# EAGLE board pico_daw_v0.3 (EAGLE 4.16), part 1 of 2
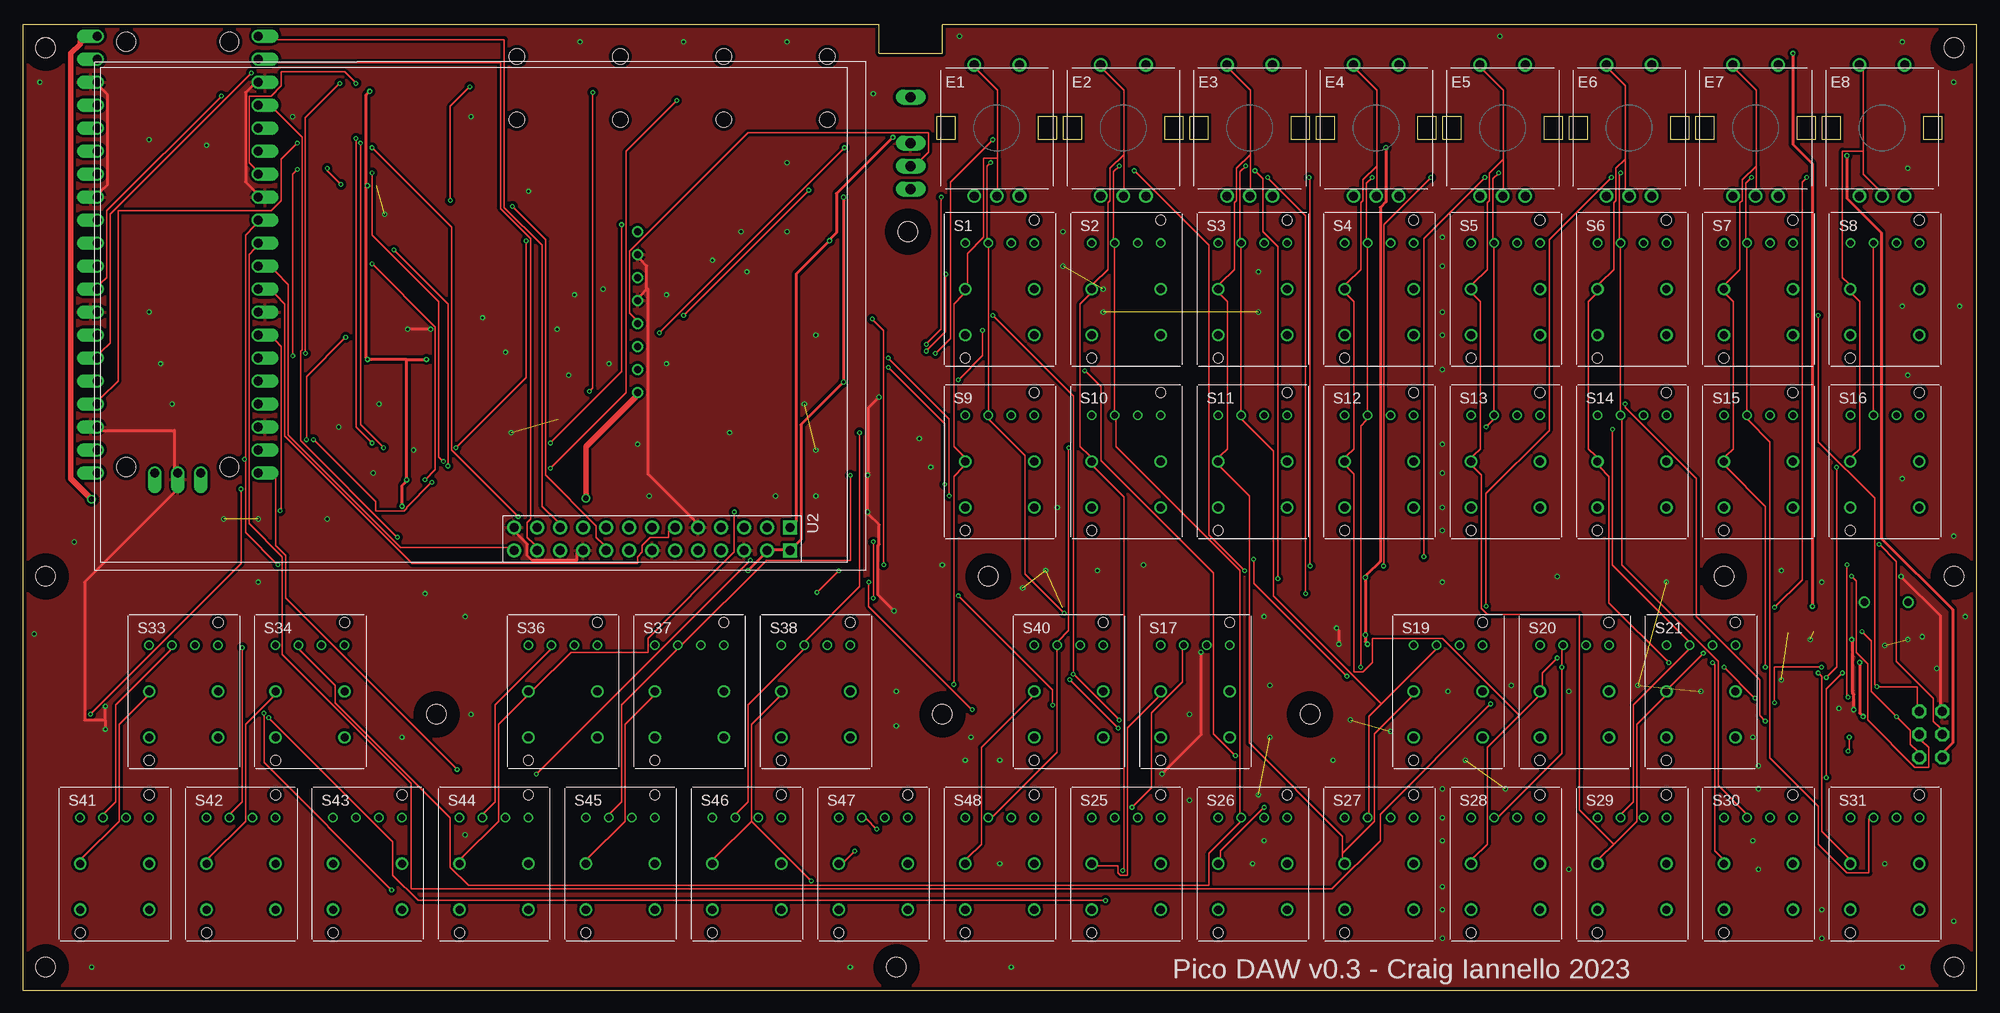
[diagram p1: board, top side]
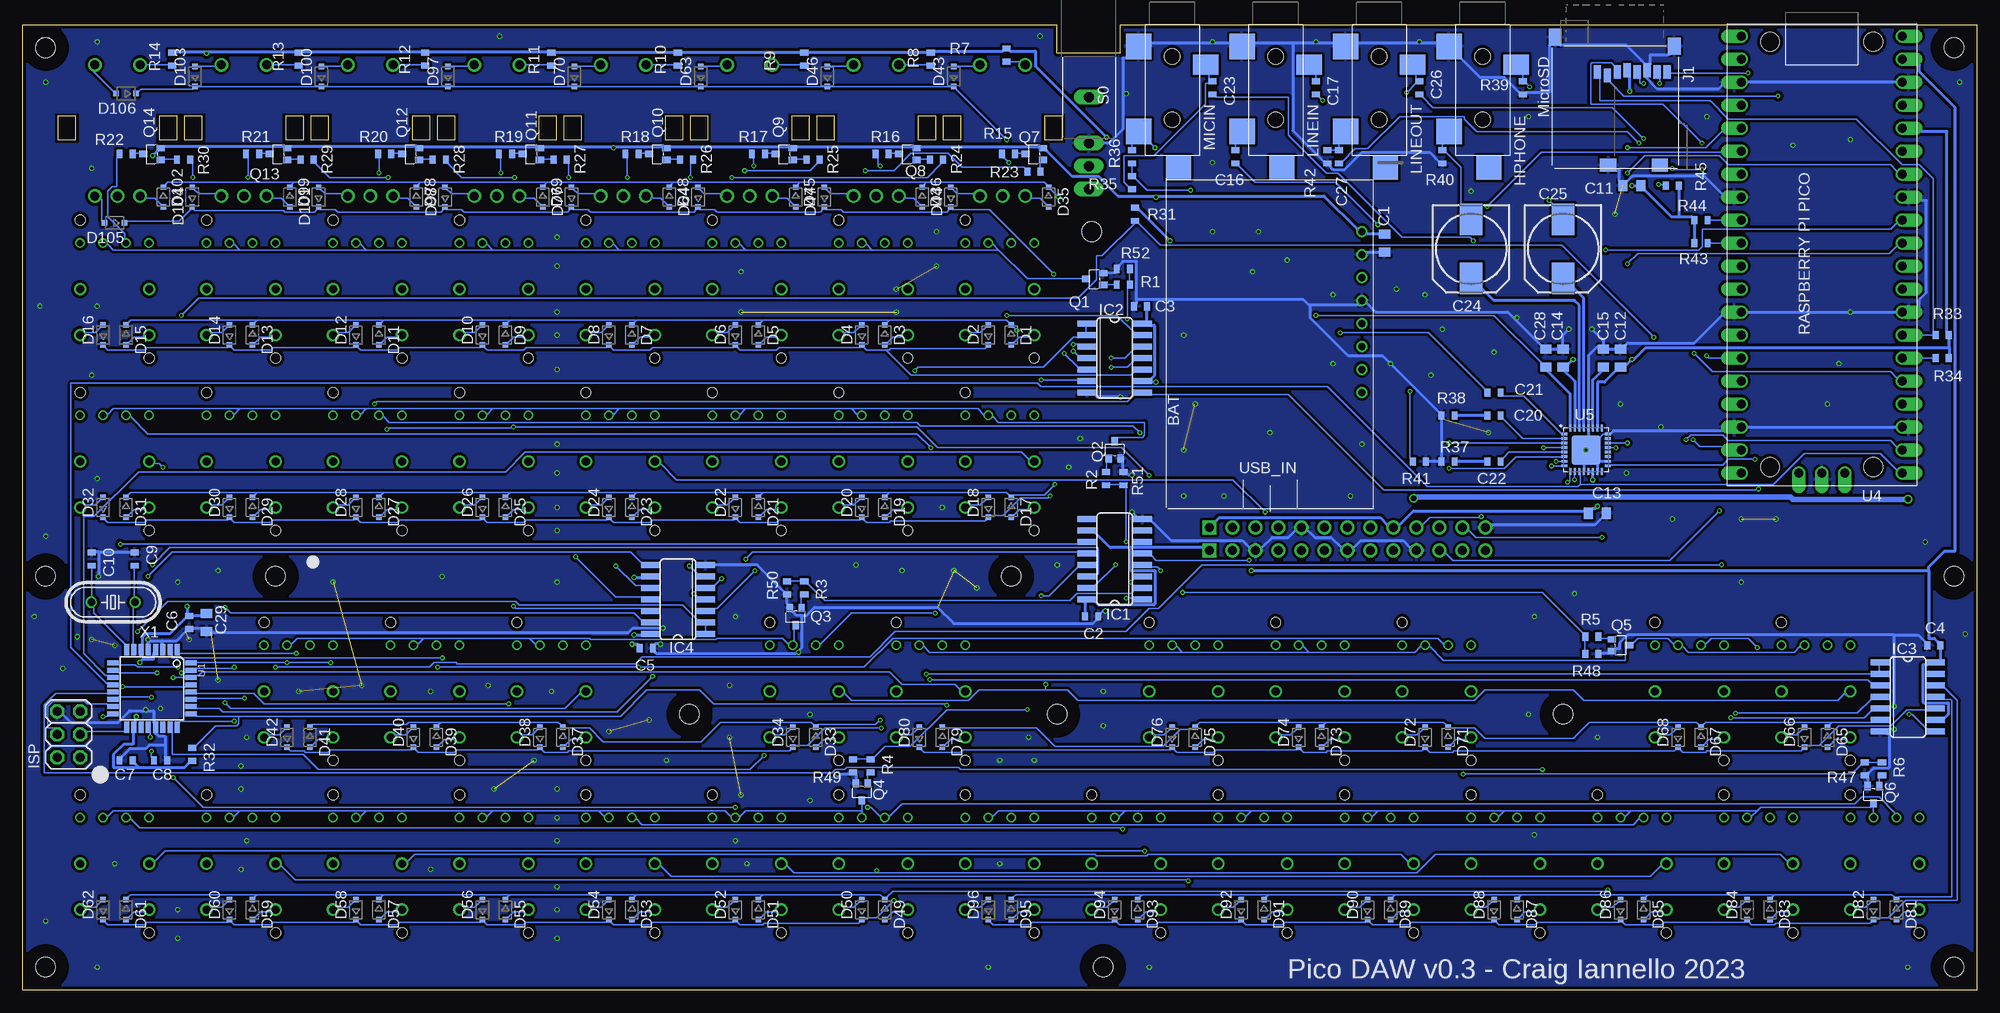
[diagram p2: board, bottom side, seen from below]

Size 215.9 x 106.68 mm. Coordinates in mm from the lower left corner, seen from the top.
Outline: 0,0 215.9,0 215.9,106.68 101.6,106.68 101.6,103.5 94.61,103.5 94.61,106.68 0,106.68 0,0
Copper layers (1*16): Top 0.0356mm / dielectric 1.6mm / Bottom 0.0356mm
Design rules "oshpark-2layer": minimum track width 6mil, minimum drill 10mil, track to track 6mil, track to pad 6mil, pad to pad 6mil, via to via 6mil, smd to smd 6mil, copper to edge 15mil, drill to drill 6mil, minimum pad ring 5mil, minimum via ring 5mil, stop-mask expansion 2.5mil, vias tented up to drill 0mil, thermal gap 10mil
Net classes: 0 default: width 0.152 mm, drill 0.152 mm, clearance 0.254 mm; 1 high_power: width 0.61 mm, drill 0.33 mm, clearance 0.61 mm; 2 mid_power: width 0.305 mm, drill 0.152 mm, clearance 0.305 mm
Holes 2.18 mm at 213.36,2.54 213.36,104.14 2.54,104.14 2.54,2.54 45.72,30.48 96.52,2.54 142.24,30.48 97.79,83.82 213.36,45.72 106.68,45.72 2.54,45.72 101.6,30.48 187.96,45.72
tRestrict: area 0,101.6 to 5.1,106.7; area 0,43.2 to 5.1,48.3; area 0,0 to 5.1,5.1; area 43.2,27.9 to 48.3,33; area 99.1,27.9 to 104.1,33; area 104.1,43.2 to 109.2,48.3; area 95.2,81.3 to 100.3,86.4; area 94,0 to 99.1,5.1; area 139.7,27.9 to 144.8,33; area 185.4,43.2 to 190.5,48.3; area 210.8,43.2 to 215.9,48.3; area 210.8,0 to 215.9,5.1; 1 more areas
bRestrict: area 0,101.6 to 5.1,106.7; area 0,43.2 to 5.1,48.3; area 0,0 to 5.1,5.1; area 43.2,27.9 to 48.3,33; area 99.1,27.9 to 104.1,33; area 104.1,43.2 to 109.2,48.3; area 95.2,81.3 to 100.3,86.4; area 94,0 to 99.1,5.1; area 139.7,27.9 to 144.8,33; area 185.4,43.2 to 190.5,48.3; area 210.8,43.2 to 215.9,48.3; area 210.8,0 to 215.9,5.1; 1 more areas

## Footprints (pad centres in the part's own frame; a part is rotated, then mirrored left to right if it is on the bottom)
0805 = smd 1.25 x 1: 1 0,1; 2 0,-1
0603 = smd 0.65 x 0.9: 1 -0.725,0; 2 0.725,0
150CLZ-0810 = smd 3.5 x 2.5: + 3.25,0; - -3.25,0
SOD323-R = smd 0.6 x 0.6: A 1.1,0; C -1.1,0
ENCODER_BOURNS_PEC12R-3225F-S0024 = drill 1 round: A -2.5,-7.5; B 2.5,-7.5; COM 0,-7.5; SW0 -2.5,7; SW1 2.5,7
HPHONE_CUI_SJ-3524-SMT-TR = smd 2.2 x 2.8: RING 4.4,3.7 | smd 2.8 x 2.8: SLEEVE 2.4,-3.7; TIP 11.8,-3.7 | smd 2.6 x 2.8: SWITCH 15.8,0.7 | hole 1.7: 3.5,0; 10.5,0
SO16 = smd 0.66 x 2.032: 1 -4.445,-3.073; 2 -3.175,-3.073; 3 -1.905,-3.073; 4 -0.635,-3.073; 5 0.635,-3.073; 6 1.905,-3.073; 7 3.175,-3.073; 8 4.445,-3.073; 9 4.445,3.073; 10 3.175,3.073; 11 1.905,3.073; 12 0.635,3.073; 13 -0.635,3.073; 14 -1.905,3.073; 15 -3.175,3.073; 16 -4.445,3.073
SO14 = smd 0.66 x 2.032: 1 -3.81,-3.073; 2 -2.54,-3.073; 3 -1.27,-3.073; 4 0,-3.073; 5 1.27,-3.073; 6 2.54,-3.073; 7 3.81,-3.073; 8 3.81,3.073; 9 2.54,3.073; 10 1.27,3.073; 11 0,3.073; 12 -1.27,3.073; 13 -2.54,3.073; 14 -3.81,3.073
2X03 = drill 1.016 octagon: 1 -2.54,-1.27; 2 -2.54,1.27; 3 0,-1.27; 4 0,1.27; 5 2.54,-1.27; 6 2.54,1.27
MICROSD_AMPHENOL_GTFP08432B1HR = smd 0.8 x 1.5: 1/DAT2 1.95,1.8; 2/CD/DAT3 0.85,2.2; 3/CMD -0.25,1.8; 4/VDD -1.35,1.6; 5/CLK -2.45,1.8; 6/VSS -3.55,1.6; 7/DAT0 -4.65,1.8; 8/DAT1 -5.75,1.8 | smd 1.8 x 1.4: CDET -4.95,12.1; GND0 0.75,12.1 | smd 1.4 x 1.9: GND1 -6.55,-1.05; GND2 6.6,-2.05
SC-70-3_SOT-323 = smd 0.7 x 0.9: 1 -0.65,-0.95; 2 0.65,-0.95; 3 0,0.95
ROCKER_SPDT_EG4328-ND = drill 1.09 long: 1 0,-5.135; 2 0,-7.675; 3 0,-10.215; ANCH 0,-0.055
PAD_PB86-A1 = drill 0.7 round: A -1.27,5.08; K 1.27,5.08; NC0 -3.81,5.08; NC1 3.81,5.08 | drill 0.9 round: COM0 -3.81,0; COM1 3.81,0; NC 3.81,-5.08; NO -3.81,-5.08 | hole 1.1: -3.81,-7.62; 3.81,7.62
TQFP32-08 = smd 1.27 x 0.559: 1 -4.293,2.8; 2 -4.293,2; 3 -4.293,1.2; 4 -4.293,0.4; 5 -4.293,-0.4; 6 -4.293,-1.2; 7 -4.293,-2; 8 -4.293,-2.8; 17 4.293,-2.8; 18 4.293,-2; 19 4.293,-1.2; 20 4.293,-0.4; 21 4.293,0.4; 22 4.293,1.2; 23 4.293,2; 24 4.293,2.8 | smd 0.559 x 1.27: 9 -2.8,-4.293; 10 -2,-4.293; 11 -1.2,-4.293; 12 -0.4,-4.293; 13 0.4,-4.293; 14 1.2,-4.293; 15 2,-4.293; 16 2.8,-4.293; 25 2.8,4.293; 26 2,4.293; 27 1.2,4.293; 28 0.4,4.293; 29 -0.4,4.293; 30 -1.2,4.293; 31 -2,4.293; 32 -2.8,4.293
WAVESHARE_SPI_3.5_480X320 = drill 1.016 square: 1 0,-2.54; 2 0,0 | drill 1.016 round: 3 2.54,-2.54; 4 2.54,0; 5 5.08,-2.54; 6 5.08,0; 7 7.62,-2.54; 8 7.62,0; 9 10.16,-2.54; 10 10.16,0; 11 12.7,-2.54; 12 12.7,0; 13 15.24,-2.54; 14 15.24,0; 15 17.78,-2.54; 16 17.78,0; 17 20.32,-2.54; 18 20.32,0; 19 22.86,-2.54; 20 22.86,0; 21 25.4,-2.54; 22 25.4,0; 23 27.94,-2.54; 24 27.94,0; 25 30.48,-2.54; 26 30.48,0
ADAFRUIT_POWERBOOST_1000C = drill 0.8 round: 5V 8.89,0; BAT -6.35,0; EN -1.27,0; GND0 1.27,0; GND1 6.35,0; LOWBAT 3.81,0; USB -8.89,0; VS -3.81,0
PI_PICO = drill 1 offset: 1 -8.89,24.13; 2 -8.89,21.59; 3 -8.89,19.05; 4 -8.89,16.51; 5 -8.89,13.97; 6 -8.89,11.43; 7 -8.89,8.89; 8 -8.89,6.35; 9 -8.89,3.81; 10 -8.89,1.27; 11 -8.89,-1.27; 12 -8.89,-3.81; 13 -8.89,-6.35; 14 -8.89,-8.89; 15 -8.89,-11.43; 16 -8.89,-13.97; 17 -8.89,-16.51; 18 -8.89,-19.05; 19 -8.89,-21.59; 20 -8.89,-24.13; 21 8.89,-24.13; 22 8.89,-21.59; 23 8.89,-19.05; 24 8.89,-16.51; 25 8.89,-13.97; 26 8.89,-11.43; 27 8.89,-8.89; 28 8.89,-6.35; 29 8.89,-3.81; 30 8.89,-1.27; 31 8.89,1.27; 32 8.89,3.81; 33 8.89,6.35; 34 8.89,8.89; 35 8.89,11.43; 36 8.89,13.97; 37 8.89,16.51; 38 8.89,19.05; 39 8.89,21.59; 40 8.89,24.13; D1 -2.54,-24.13; D2 0,-24.13; D3 2.54,-24.13 | hole 2.1: -5.7,23.5; 5.7,23.5; 5.7,-23.5; -5.7,-23.5
QFN32 = smd 0.75 x 0.3: 1 -2.4,1.75; 2 -2.4,1.25; 3 -2.4,0.75; 4 -2.4,0.25; 5 -2.4,-0.25; 6 -2.4,-0.75; 7 -2.4,-1.25; 8 -2.4,-1.75; 17 2.4,-1.75; 18 2.4,-1.25; 19 2.4,-0.75; 20 2.4,-0.25; 21 2.4,0.25; 22 2.4,0.75; 23 2.4,1.25; 24 2.4,1.75 | smd 0.3 x 0.75: 9 -1.75,-2.4; 10 -1.25,-2.4; 11 -0.75,-2.4; 12 -0.25,-2.4; 13 0.25,-2.4; 14 0.75,-2.4; 15 1.25,-2.4; 16 1.75,-2.4; 25 1.75,2.4; 26 1.25,2.4; 27 0.75,2.4; 28 0.25,2.4; 29 -0.25,2.4; 30 -0.75,2.4; 31 -1.25,2.4; 32 -1.75,2.4 | smd 3.2 x 3.2: EXP 0,0
HC49/S = drill 0.813 round: 1 -2.413,0; 2 2.413,0

## Placement (x,y rotation side)
C1  10u  [0805]  65.43,82.55 0 bottom
C2  0.1u  [0603]  97.79,41.27 0 bottom
C3  0.1u  [0603]  92.39,75.56 180 bottom
C4  0.1u  [0603]  4.76,38.1 180 bottom
C5  0.1u  [0603]  147,37.78 0 bottom
C6  0.1u  [0603]  197.49,40.64 270 bottom
C7  0.1u  [0603]  204.47,25.4 180 bottom
C8  0.1u  [0603]  200.66,25.4 0 bottom
C9  22p  [0603]  203.52,47.62 270 bottom
C10  22p  [0603]  208.28,47.62 270 bottom
C11  10u  [0805]  38.1,88.9 270 bottom
C12  10u  [0805]  39.37,69.85 180 bottom
C13  10u  [0805]  41.91,52.7 90 bottom
C14  10u  [0805]  45.72,69.85 180 bottom
C15  10u  [0805]  41.27,69.85 180 bottom
C16  1u  [0603]  81.92,92.08 270 bottom
C17  1u  [0603]  73.03,99.69 270 bottom
C20  1u  [0603]  53.34,63.5 0 bottom
C21  1u  [0603]  53.34,66.04 0 bottom
C22  1u  [0603]  53.34,58.42 0 bottom
C23  1u  [0603]  84.45,99.69 270 bottom
C24  220u  [150CLZ-0810]  55.88,81.92 270 bottom
C25  220u  [150CLZ-0810]  45.72,81.92 270 bottom
C26  1u  [0603]  61.59,99.69 90 bottom
C27  1u  [0603]  70.48,92.08 90 bottom
C28  10u  [0805]  47.62,69.85 180 bottom
C29  10u  [0805]  195.58,40.64 0 bottom
D1  [SOD323-R]  106.68,72.39 270 bottom
D2  [SOD323-R]  109.22,72.39 90 bottom
D3  [SOD323-R]  120.65,72.39 270 bottom
D4  [SOD323-R]  123.19,72.39 90 bottom
D5  [SOD323-R]  134.62,72.39 270 bottom
D6  [SOD323-R]  137.16,72.39 90 bottom
D7  [SOD323-R]  148.59,72.39 270 bottom
D8  [SOD323-R]  151.13,72.39 90 bottom
D9  [SOD323-R]  162.56,72.39 270 bottom
D10  [SOD323-R]  165.1,72.39 90 bottom
D11  [SOD323-R]  176.53,72.39 270 bottom
D12  [SOD323-R]  179.07,72.39 90 bottom
D13  [SOD323-R]  190.5,72.39 270 bottom
D14  [SOD323-R]  193.04,72.39 90 bottom
D15  [SOD323-R]  204.47,72.39 270 bottom
D16  [SOD323-R]  207.01,72.39 90 bottom
D17  [SOD323-R]  106.68,53.34 270 bottom
D18  [SOD323-R]  109.22,53.34 90 bottom
D19  [SOD323-R]  120.65,53.34 270 bottom
D20  [SOD323-R]  123.19,53.34 90 bottom
D21  [SOD323-R]  134.62,53.34 270 bottom
D22  [SOD323-R]  137.16,53.34 90 bottom
D23  [SOD323-R]  148.59,53.34 270 bottom
D24  [SOD323-R]  151.13,53.34 90 bottom
D25  [SOD323-R]  162.56,53.34 270 bottom
D26  [SOD323-R]  165.1,53.34 90 bottom
D27  [SOD323-R]  176.53,53.34 270 bottom
D28  [SOD323-R]  179.07,53.34 90 bottom
D29  [SOD323-R]  190.5,53.34 270 bottom
D30  [SOD323-R]  193.04,53.34 90 bottom
D31  [SOD323-R]  204.47,53.34 270 bottom
D32  [SOD323-R]  207.01,53.34 90 bottom
D33  [SOD323-R]  128.27,27.94 270 bottom
D34  [SOD323-R]  130.81,27.94 90 bottom
D35  [SOD323-R]  102.55,87.63 270 bottom
D36  [SOD323-R]  113.35,87.63 90 bottom
D37  [SOD323-R]  156.21,27.94 270 bottom
D38  [SOD323-R]  158.75,27.94 90 bottom
D39  [SOD323-R]  170.18,27.94 270 bottom
D40  [SOD323-R]  172.72,27.94 90 bottom
D41  [SOD323-R]  184.15,27.94 270 bottom
D42  [SOD323-R]  186.69,27.94 90 bottom
D43  [SOD323-R]  113.03,100.97 90 bottom
D44  [SOD323-R]  116.52,87.63 270 bottom
D45  [SOD323-R]  127.32,87.63 90 bottom
D46  [SOD323-R]  127,100.97 90 bottom
D47  [SOD323-R]  130.49,87.63 270 bottom
D48  [SOD323-R]  141.29,87.63 90 bottom
D49  [SOD323-R]  120.65,8.89 270 bottom
D50  [SOD323-R]  123.19,8.89 90 bottom
D51  [SOD323-R]  134.62,8.89 270 bottom
D52  [SOD323-R]  137.16,8.89 90 bottom
D53  [SOD323-R]  148.59,8.89 270 bottom
D54  [SOD323-R]  151.13,8.89 90 bottom
D55  [SOD323-R]  162.56,8.89 270 bottom
D56  [SOD323-R]  165.1,8.89 90 bottom
D57  [SOD323-R]  176.53,8.89 270 bottom
D58  [SOD323-R]  179.07,8.89 90 bottom
D59  [SOD323-R]  190.5,8.89 270 bottom
D60  [SOD323-R]  193.04,8.89 90 bottom
D61  [SOD323-R]  204.47,8.89 270 bottom
D62  [SOD323-R]  207.01,8.89 90 bottom
D63  [SOD323-R]  140.97,100.97 90 bottom
D64  [SOD323-R]  144.46,87.63 270 bottom
D65  [SOD323-R]  16.51,27.94 270 bottom
D66  [SOD323-R]  19.05,27.94 90 bottom
D67  [SOD323-R]  30.48,27.94 270 bottom
D68  [SOD323-R]  33.02,27.94 90 bottom
D69  [SOD323-R]  155.26,87.63 90 bottom
D70  [SOD323-R]  154.94,100.97 90 bottom
D71  [SOD323-R]  58.42,27.94 270 bottom
D72  [SOD323-R]  60.96,27.94 90 bottom
D73  [SOD323-R]  72.39,27.94 270 bottom
D74  [SOD323-R]  74.93,27.94 90 bottom
D75  [SOD323-R]  86.36,27.94 270 bottom
D76  [SOD323-R]  88.9,27.94 90 bottom
D77  [SOD323-R]  158.43,87.63 270 bottom
D78  [SOD323-R]  169.23,87.63 90 bottom
D79  [SOD323-R]  114.3,27.94 270 bottom
D80  [SOD323-R]  116.84,27.94 90 bottom
D81  [SOD323-R]  8.89,8.89 270 bottom
D82  [SOD323-R]  11.43,8.89 90 bottom
D83  [SOD323-R]  22.86,8.89 270 bottom
D84  [SOD323-R]  25.4,8.89 90 bottom
D85  [SOD323-R]  36.83,8.89 270 bottom
D86  [SOD323-R]  39.37,8.89 90 bottom
D87  [SOD323-R]  50.8,8.89 270 bottom
D88  [SOD323-R]  53.34,8.89 90 bottom
D89  [SOD323-R]  64.77,8.89 270 bottom
D90  [SOD323-R]  67.31,8.89 90 bottom
D91  [SOD323-R]  78.74,8.89 270 bottom
D92  [SOD323-R]  81.28,8.89 90 bottom
D93  [SOD323-R]  92.71,8.89 270 bottom
D94  [SOD323-R]  95.25,8.89 90 bottom
D95  [SOD323-R]  106.68,8.89 270 bottom
D96  [SOD323-R]  109.22,8.89 90 bottom
D97  [SOD323-R]  168.91,100.97 90 bottom
D98  [SOD323-R]  172.4,87.63 270 bottom
D99  [SOD323-R]  183.2,87.63 90 bottom
D100  [SOD323-R]  182.88,100.97 90 bottom
D101  [SOD323-R]  186.37,87.63 270 bottom
D102  [SOD323-R]  197.17,87.63 90 bottom
D103  [SOD323-R]  196.85,100.97 90 bottom
D104  [SOD323-R]  200.34,87.63 270 bottom
D105  [SOD323-R]  205.74,84.77 180 bottom
D106  [SOD323-R]  204.47,99.06 180 bottom
E1  ENCODER_BOURNS_PEC12R-3225F-S0024  [ENCODER_BOURNS_PEC12R-3225F-S0024]  107.63,95.25 0 top
E2  ENCODER_BOURNS_PEC12R-3225F-S0024  [ENCODER_BOURNS_PEC12R-3225F-S0024]  121.6,95.25 0 top
E3  ENCODER_BOURNS_PEC12R-3225F-S0024  [ENCODER_BOURNS_PEC12R-3225F-S0024]  135.57,95.25 0 top
E4  ENCODER_BOURNS_PEC12R-3225F-S0024  [ENCODER_BOURNS_PEC12R-3225F-S0024]  149.54,95.25 0 top
E5  ENCODER_BOURNS_PEC12R-3225F-S0024  [ENCODER_BOURNS_PEC12R-3225F-S0024]  163.51,95.25 0 top
E6  ENCODER_BOURNS_PEC12R-3225F-S0024  [ENCODER_BOURNS_PEC12R-3225F-S0024]  177.48,95.25 0 top
E7  ENCODER_BOURNS_PEC12R-3225F-S0024  [ENCODER_BOURNS_PEC12R-3225F-S0024]  191.45,95.25 0 top
E8  ENCODER_BOURNS_PEC12R-3225F-S0024  [ENCODER_BOURNS_PEC12R-3225F-S0024]  205.42,95.25 0 top
HPHONE  [HPHONE_CUI_SJ-3524-SMT-TR]  54.61,106.68 270 bottom
IC1  74LS595D  [SO16]  95.25,47.62 90 bottom
IC2  74LS164D  [SO14]  95.25,69.85 270 bottom
IC3  74LS164D  [SO14]  7.62,32.38 270 bottom
IC4  74LS164D  [SO14]  143.51,43.18 90 bottom
ISP  [2X03]  210.82,28.26 90 bottom
J1  MICROSD_AMPHENOL_GTFP084328  [MICROSD_AMPHENOL_GTFP08432B1HR]  39.98,103.25 180 bottom
LINEIN  [HPHONE_CUI_SJ-3524-SMT-TR]  77.47,106.68 270 bottom
LINEOUT  [HPHONE_CUI_SJ-3524-SMT-TR]  66.04,106.68 270 bottom
MICIN  [HPHONE_CUI_SJ-3524-SMT-TR]  88.9,106.68 270 bottom
Q1  MMBT2222AWT3G  [SC-70-3_SOT-323]  97.47,78.58 90 bottom
Q2  MMBT2222AWT3G  [SC-70-3_SOT-323]  95.25,59.69 0 bottom
Q3  MMBT2222AWT3G  [SC-70-3_SOT-323]  130.49,41.27 180 bottom
Q4  2N2222MMBT2222AWT3G?  [SC-70-3_SOT-323]  123.19,21.91 180 bottom
Q5  2N2222MMBT2222AWT3G?  [SC-70-3_SOT-323]  39.37,38.1 270 bottom
Q6  2N2222MMBT2222AWT3G?  [SC-70-3_SOT-323]  11.43,21.59 180 bottom
Q7  2N2907MMBT2907AWT1G?  [SC-70-3_SOT-323]  104.14,92.39 90 bottom
Q8  2N2907MMBT2907AWT1G?  [SC-70-3_SOT-323]  118.11,92.39 90 bottom
Q9  2N2907MMBT2907AWT1G?  [SC-70-3_SOT-323]  131.76,92.39 90 bottom
Q10  2N2907MMBT2907AWT1G?  [SC-70-3_SOT-323]  145.73,92.39 90 bottom
Q11  2N2907MMBT2907AWT1G?  [SC-70-3_SOT-323]  159.7,92.39 90 bottom
Q12  2N2907MMBT2907AWT1G?  [SC-70-3_SOT-323]  173.04,92.39 90 bottom
Q13  2N2907MMBT2907AWT1G?  [SC-70-3_SOT-323]  187.64,92.39 90 bottom
Q14  2N2907MMBT2907AWT1G?  [SC-70-3_SOT-323]  201.61,92.39 90 bottom
R1  1K  [0603]  94.3,77.95 180 bottom
R2  1K  [0603]  96.2,56.52 90 bottom
R3  1K  [0603]  129.54,44.45 270 bottom
R4  1K  [0603]  122.24,24.77 270 bottom
R5  1K  [0603]  42.55,39.05 0 bottom
R6  1K  [0603]  10.48,24.45 270 bottom
R7  4.7K  [0603]  107.21,103.33 270 bottom
R8  4.7K  [0603]  115.57,102.87 270 bottom
R9  4.7K  [0603]  129.54,102.87 270 bottom
R10  4.7K  [0603]  143.51,102.87 270 bottom
R11  4.7K  [0603]  157.48,102.87 270 bottom
R12  4.7K  [0603]  171.45,102.87 270 bottom
R13  4.7K  [0603]  185.42,102.87 270 bottom
R14  4.7K  [0603]  199.39,102.87 270 bottom
R15  150R  [0603]  107,92.39 0 bottom
R16  150R  [0603]  120.97,92.39 0 bottom
R17  150R  [0603]  134.62,92.39 0 bottom
R18  150R  [0603]  148.59,92.39 0 bottom
R19  150R  [0603]  162.56,92.39 0 bottom
R20  150R  [0603]  175.9,92.39 0 bottom
R21  150R  [0603]  190.5,92.39 0 bottom
R22  150R  [0603]  204.47,92.39 0 bottom
R23  1K  [0603]  104.18,90.44 0 bottom
R24  1K  [0603]  114.94,91.76 180 bottom
R25  1K  [0603]  128.59,91.76 180 bottom
R26  1K  [0603]  142.56,91.76 180 bottom
R27  1K  [0603]  156.53,91.76 180 bottom
R28  1K  [0603]  169.86,91.76 180 bottom
R29  1K  [0603]  184.47,91.76 180 bottom
R30  1K  [0603]  198.12,91.76 180 bottom
R31  10k  [0603]  93.03,85.72 270 bottom
R32  10k  [0603]  197.17,26.04 270 bottom
R33  10k  [0603]  3.81,72.39 180 bottom
R34  10k  [0603]  3.81,69.85 180 bottom
R35  2.2k  [0603]  93.34,89.22 90 bottom
R36  2.2k  [0603]  93.34,92.08 270 bottom
R37  0R  [0603]  58.42,58.42 0 bottom
R38  0R  [0603]  58.42,63.5 0 bottom
R39  ?R  [0603]  50.16,99.69 90 bottom
R40  ?R  [0603]  59.05,92.08 90 bottom
R41  ?R  [0603]  61.59,58.42 180 bottom
R42  ?R  [0603]  71.75,92.08 90 bottom
R43  4.7k  [0603]  30.48,82.55 180 bottom
R44  4.7k  [0603]  30.48,85.09 180 bottom
R45  10k  [0603]  33.66,88.9 180 bottom
R47  4.7k  [0603]  12.38,24.45 270 bottom
R48  4.7k  [0603]  42.55,37.15 0 bottom
R49  4.7k  [0603]  124.14,24.77 270 bottom
R50  4.7k  [0603]  131.44,44.45 270 bottom
R51  4.7k  [0603]  94.3,56.52 90 bottom
R52  4.7k  [0603]  94.3,79.69 180 bottom
S0  ROCKEREG4328-ND  [ROCKER_SPDT_EG4328-ND]  98.11,98.74 0 bottom
S1  PB8601-A1  [PAD_PB86-A1]  107.95,77.47 0 top
S2  PB8601-A1  [PAD_PB86-A1]  121.92,77.47 0 top
S3  PB8601-A1  [PAD_PB86-A1]  135.89,77.47 0 top
S4  PB8601-A1  [PAD_PB86-A1]  149.86,77.47 0 top
S5  PB8601-A1  [PAD_PB86-A1]  163.83,77.47 0 top
S6  PB8601-A1  [PAD_PB86-A1]  177.8,77.47 0 top
S7  PB8601-A1  [PAD_PB86-A1]  191.77,77.47 0 top
S8  PB8601-A1  [PAD_PB86-A1]  205.74,77.47 0 top
S9  PB8601-A1  [PAD_PB86-A1]  107.95,58.42 0 top
S10  PB8601-A1  [PAD_PB86-A1]  121.92,58.42 0 top
S11  PB8601-A1  [PAD_PB86-A1]  135.89,58.42 0 top
S12  PB8601-A1  [PAD_PB86-A1]  149.86,58.42 0 top
S13  PB8601-A1  [PAD_PB86-A1]  163.83,58.42 0 top
S14  PB8601-A1  [PAD_PB86-A1]  177.8,58.42 0 top
S15  PB8601-A1  [PAD_PB86-A1]  191.77,58.42 0 top
S16  PB8601-A1  [PAD_PB86-A1]  205.74,58.42 0 top
S17  PB8601-A1  [PAD_PB86-A1]  129.54,33.02 0 top
S19  PB8601-A1  [PAD_PB86-A1]  157.48,33.02 0 top
S20  PB8601-A1  [PAD_PB86-A1]  171.45,33.02 0 top
S21  PB8601-A1  [PAD_PB86-A1]  185.42,33.02 0 top
S25  PB8601-A1  [PAD_PB86-A1]  121.92,13.97 0 top
S26  PB8601-A1  [PAD_PB86-A1]  135.89,13.97 0 top
S27  PB8601-A1  [PAD_PB86-A1]  149.86,13.97 0 top
S28  PB8601-A1  [PAD_PB86-A1]  163.83,13.97 0 top
S29  PB8601-A1  [PAD_PB86-A1]  177.8,13.97 0 top
S30  PB8601-A1  [PAD_PB86-A1]  191.77,13.97 0 top
S31  PB8601-A1  [PAD_PB86-A1]  205.74,13.97 0 top
S33  PB8601-A1  [PAD_PB86-A1]  17.78,33.02 0 top
S34  PB8601-A1  [PAD_PB86-A1]  31.75,33.02 0 top
S36  PB8601-A1  [PAD_PB86-A1]  59.69,33.02 0 top
S37  PB8601-A1  [PAD_PB86-A1]  73.66,33.02 0 top
S38  PB8601-A1  [PAD_PB86-A1]  87.63,33.02 0 top
S40  PB8601-A1  [PAD_PB86-A1]  115.57,33.02 0 top
S41  PB8601-A1  [PAD_PB86-A1]  10.16,13.97 0 top
S42  PB8601-A1  [PAD_PB86-A1]  24.13,13.97 0 top
S43  PB8601-A1  [PAD_PB86-A1]  38.1,13.97 0 top
S44  PB8601-A1  [PAD_PB86-A1]  52.07,13.97 0 top
S45  PB8601-A1  [PAD_PB86-A1]  66.04,13.97 0 top
S46  PB8601-A1  [PAD_PB86-A1]  80.01,13.97 0 top
S47  PB8601-A1  [PAD_PB86-A1]  93.98,13.97 0 top
S48  PB8601-A1  [PAD_PB86-A1]  107.95,13.97 0 top
U1  ATMEGA238PTQFP_  [TQFP32-08]  201.61,33.34 270 bottom
U2  LCD_SPI_3.5_WAVESHARE_480X320  [WAVESHARE_SPI_3.5_480X320]  84.77,48.58 180 top
U3  ADAFRUIT_POWERBOOST_1000C  [ADAFRUIT_POWERBOOST_1000C]  67.94,74.93 90 bottom
U4  PI_PICO  [PI_PICO]  17.14,81.28 0 bottom
U5  AUDIO_CODEC_I2S_SPI_NAU88C22YG_NAU88C22YG-ND  [QFN32]  43.18,59.69 0 bottom
X1  12M  [HC49/S]  205.9,42.86 180 bottom

## Tracks (layer width: path | path; a pad name or v marks a point on that pad's centre or on a via)
+3V3  (via drill 0.3)
  Top 0.305: 42.42,69.69 v44.61,69.69 | 42.42,69.69 v38.1,69.69 37.97,69.85 37.97,88.9 | 42.42,69.69 v42.42,56.39 42.29,56.13 41.91,55.75 v41.91,53.47 | v38.35,99.31 37.97,98.93 37.97,88.9 | 37.97,88.9 v38.1,88.9 | U2.1 85.47,51.82 85.47,79.12 v89.15,82.8 89.28,83.06 89.92,83.69 89.92,88.01 v96.14,94.23 | v203.33,30.23 202.95,30.61 v202.95,36.2 | v197.74,42.42 197.74,91.31 195.58,93.47 v195.58,103.5
  Bottom 0.305: U5.31 44.43,67.29 45.72,68.58 C14.1 45.72,68.9 45.4,68.9 v44.61,69.69 | 3.05,70.99 3.05,72.01 R33.1 3.3,72.77 3.3,94.87 6.1,94.87 U4.36 | 3.05,70.99 3.05,70.23 R34.1 | R43.2 31.24,82.93 31.24,84.71 R44.2 31.5,85.47 32.89,85.47 | 32.89,85.47 33.78,85.47 36.7,88.39 C11.1 v38.1,88.9 | U5.13 42.8,57.28 42.55,57.28 U5.14 42.42,57.02 v42.42,56.39 | U5.26 41.91,62.36 41.91,67.18 41.15,67.18 39.88,68.45 C12.1 39.37,69.06 38.73,69.06 v38.1,69.69 37.85,69.72 36.58,70.99 3.05,70.99 | v38.35,99.31 38.35,100.97 J1.4/VDD | v89.15,82.8 92.58,86.23 R31.1 | U2.1 83.69,52.2 65.91,52.2 65.15,51.44 U2.17 63.75,51.44 62.23,52.96 43.31,52.96 C13.1 42.42,53.21 42.16,53.21 v41.91,53.47 | 203.07,24.64 197.99,24.64 197.61,25.02 R32.2 | 203.07,24.64 203.45,25.02 C7.1 | 203.07,24.64 205.87,24.64 205.87,26.04 204.72,27.18 203.71,27.18 203.71,28.45 U1.18 203.45,29.59 203.45,30.23 v203.33,30.23 | C6.1 197.1,41.4 196.09,41.4 C29.1 | 202.44,36.58 201.42,36.58 201.42,37.08 U1.4 | 202.44,36.58 202.95,37.08 U1.6 202.69,38.23 202.69,38.99 202.31,39.37 199.64,39.37 197.87,41.15 C6.1 | v202.95,36.2 202.56,36.58 202.44,36.58 | 195.58,103.63 199.01,103.63 R14.1 | 195.58,103.63 185.8,103.63 R13.1 185.04,103.63 171.83,103.63 R12.1 171.07,103.63 157.86,103.63 R11.1 157.1,103.63 143.89,103.63 R10.1 143.13,103.63 129.92,103.63 R9.1 129.16,103.63 115.95,103.63 R8.1 115.19,103.76 107.57,103.76 R7.1 106.81,103.76 104.01,103.76 104.01,102.11 v96.14,94.23 | v197.74,42.42 197.74,41.66 C6.1 | 195.58,103.63 v195.58,103.5 | R45.1 32.89,88.52 32.89,85.47
/LROE  (via drill 0.25)
  Top 0.152: v103.38,43.56 113.79,33.15 v113.79,31.5
  Bottom 0.152: 192.02,30.23 192.02,29.46 192.28,29.21 194.56,29.21 196.72,27.05 R32.1 | 192.02,30.23 196.6,30.23 196.72,30.35 U1.25 | v103.38,43.56 102.49,43.56 99.31,46.74 IC1.13 | v113.79,31.5 113.92,31.62 139.57,31.62 141.1,33.15 146.94,33.15 149.86,30.23 192.02,30.23
/RST  (via drill 0.25)
  Top 0.152: ISP.5 209.3,31.5 209.3,33.53 v204.85,33.53 204.6,33.78 204.6,54.36 198.37,60.58 v198.37,74.55 | v35.69,72.14 31.37,67.82 v31.37,60.83
  Bottom 0.152: v204.85,33.53 197.87,33.53 U1.29 | v35.69,72.14 45.85,82.3 90.17,82.3 92.58,84.71 R31.2 93.09,84.71 96.65,81.15 97.28,81.15 97.28,78.49 99.31,76.45 196.47,76.45 v198.37,74.55 | v31.37,60.83 30.61,60.07 28.19,60.07 U4.19
A_BCK  (via drill 0.25)
  Top 0.152: v46.99,57.91 46.99,75.82 v41.02,81.79
  Bottom 0.152: v46.99,57.91 45.85,57.91 U5.8 | v41.02,81.79 30.73,81.79 30.35,82.17 30.35,84.07 9.53,84.07 8.89,84.71 U4.32
A_DIN  (via drill 0.25)
  Top 0.152: v45.21,56.13 42.42,53.34 42.42,53.21 42.16,52.96 38.99,52.96 38.99,53.98 v32.13,60.83
  Bottom 0.152: v45.21,56.13 44.96,56.13 44.96,57.02 U5.9 | v32.13,60.83 31.62,61.34 28.07,61.34 27.43,60.71 9.53,60.71 8.89,60.07 U4.22
A_DOUT  (via drill 0.25)
  Top 0.152: v44.45,56.39 45.59,57.53 45.59,73.28 v38.61,80.26
  Bottom 0.152: v44.45,56.39 44.45,57.02 U5.10 | v38.61,80.26 37.47,81.41 9.65,81.41 8.89,82.17 U4.31
A_LRCLK  (via drill 0.25)
  Top 0.152: v46.48,58.42 45.97,58.93 45.97,76.07 38.61,83.44 v38.61,90.3
  Bottom 0.152: v46.48,58.42 45.85,58.42 U5.7 | v38.61,90.3 36.7,92.2 28.45,92.2 27.43,91.19 9.53,91.19 8.89,90.55 U4.34
A_MCLK
  Bottom 0.152: 43.81,55.88 43.81,57.02 U5.11 | 43.81,55.88 22.48,55.88 19.05,59.31 10.67,59.31 8.89,57.53 U4.21 | 43.81,55.88 44.07,55.63 60.71,55.63 71.75,66.67 103.38,66.67 103.76,67.06 210.57,67.06 210.57,37.85 206.63,33.91 206.5,33.91 U1.12
D_CS
  Top 0.152: U4.2 28.19,102.49 52.83,102.49 52.83,86.36 56.13,83.06 56.13,52.07 55.75,51.69 55.75,50.04 56.52,49.28 U2.24
D_MISO
  Top 0.152: U4.1 28.19,105.03 53.21,105.03 53.21,86.49 57.4,82.3 57.4,53.47 59.05,51.82 U2.21
D_MOSI  (via drill 0.25)
  Top 0.152: v38.61,93.09 47.37,84.33 47.37,59.69 v54.74,52.32
  Bottom 0.152: v38.61,93.09 29.97,93.09 28.19,94.87 U4.5 | v54.74,52.32 54.86,52.2 60.45,52.2 61.21,51.44 U2.19
D_RS  (via drill 0.25)
  Top 0.152: v54.1,86.61 57.78,82.93 57.78,56.9 63.37,51.31 63.37,50.04 64.14,49.28 U2.18
  Bottom 0.152: v54.1,86.61 48.13,92.58 28.19,92.58 U4.6
D_RST  (via drill 0.25)
  Top 0.152: v28.45,52.96 28.57,53.09 28.57,71.12 27.94,71.75 U4.14
  Bottom 0.152: v28.45,52.96 33.91,47.5 57.91,47.5 58.67,48.26 U2.22
D_SCK  (via drill 0.25)
  Top 0.152: v41.4,50.04 30.73,60.71 30.73,70.61 30.86,70.74 30.86,94.23 27.94,97.16 U4.4
  Bottom 0.152: v41.4,50.04 55.37,50.04 56.13,50.8 U2.23
GND  (via drill 0.3)  (16 unrouted)
  Top 0.305: v207.52,45.72 211.84,41.4 211.84,31.5 ISP.6 | v202.06,38.73 202.18,38.61 202.18,32.77 202.31,32.64 v202.31,30.99 | v125.86,23.88 130.18,28.19 v130.18,37.34 | v145.16,40.01 145.41,39.75 v145.41,38.23 | U4.38 8.64,99.69 9.4,98.93 9.4,89.03 8.64,88.27 U4.33 | U4.8 25.65,88.27 24.64,89.28 24.64,99.19 25.4,99.95 U4.3 | v94.61,65.53 93.47,64.39 93.47,57.15 v93.34,56.9 v93.34,52.83 93.47,52.58 94.61,51.44 94.61,49.28 94.49,49.15 94.49,43.69 v96.27,41.91 | U2.25 54.61,50.42 55.75,49.28 55.75,48.01 56.26,47.5 61.21,47.5 61.21,48.26 U2.20 | 68.96,77.47 68.2,76.71 U3.GND0 | 68.96,77.47 68.96,80.01 68.2,80.77 U3.GND1 | 9.14,29.84 v9.14,31.37 | 9.14,29.84 v9.14,28.83 | U4.23 8.89,61.85 16.76,61.85 16.76,57.78 U4.D2 16.76,54.99 6.86,45.09 6.86,29.84 9.14,29.84 | v45.09,73.03 v42.55,73.03 | U2.9 74.3,51.82 69.09,57.02 69.09,77.47 68.96,77.47
  Bottom 0.152: U5.24 41.27,61.44 43.02,59.69 v43.18,59.69
  Bottom 0.305: 41.27,71.12 41.27,70.96 | 41.27,71.12 41.91,71.12 42.93,70.1 U5.28 42.93,59.94 v43.18,59.69 | 41.27,70.96 C15.2 41.27,71.12 | 41.27,70.96 41.16,70.85 C12.2 38.86,71.25 38.61,71.5 31.24,71.5 28.19,74.55 U4.13 U4.28 6.35,75.56 6.35,76.33 5.59,77.09 5.59,87.25 6.1,87.25 U4.33 | U5.12 43.43,59.44 v43.18,59.69 | 41.91,58.44 41.93,58.44 v43.18,59.69 | 41.91,58.44 U5.18 | 41.91,58.44 41.91,58.42 41.93,58.4 U5.15 | v42.55,73.03 41.27,71.75 41.27,71.12 | v45.09,73.03 45.72,72.39 C14.2 45.72,70.8 45.77,70.85 C28.2 48.13,71.25 51.82,74.93 66.42,74.93 67.44,75.95 U3.GND0 68.2,75.69 73.66,75.69 | 200.53,38.61 200.53,38.23 U1.3 | 201.8,38.61 200.53,38.61 | 201.8,38.61 202.18,38.23 U1.5 | 200.53,38.61 198.88,38.61 197.87,39.62 C6.2 197.1,40.01 196.09,40.01 C29.2 195.07,39.5 148.97,39.5 148.46,40.01 v145.16,40.01 | 200.15,27.05 200.15,28.07 200.91,28.07 201.29,28.45 U1.21 201.42,29.59 201.42,30.86 202.31,30.86 | 200.15,27.05 200.15,25.78 C8.2 | C7.2 204.98,25.78 204.09,26.67 202.31,26.67 201.93,27.05 200.15,27.05 | 207.52,48.39 207.9,48.39 C10.1 | 207.52,48.39 203.96,48.39 C9.1 | 207.52,48.39 v207.52,45.72 | 202.31,30.86 204.09,30.86 205.36,29.59 210.57,29.59 211.46,30.48 ISP.6 | v202.06,38.73 201.93,38.61 201.8,38.61 | 202.31,30.86 v202.31,30.99 | Q4.2 123.83,23.24 123.83,23.75 R49.2 124.59,23.88 v125.86,23.88 | 129.79,41.4 130.43,41.4 130.81,41.78 Q3.2 131.44,42.67 R50.2 131.7,43.94 134.75,46.99 IC4.7 | 129.79,41.4 129.29,41.4 128.4,42.29 114.81,42.29 113.03,40.51 97.66,40.51 97.28,40.89 C2.2 96.77,41.66 96.52,41.91 v96.27,41.91 | 130.24,37.4 129.79,37.85 129.79,41.4
  Bottom 0.305: 130.24,37.4 130.43,37.21 145.92,37.21 146.05,37.34 C5.2 146.05,38.23 v145.41,38.23 | 130.24,37.4 v130.18,37.34 | R40.1 59.44,91.57 60.45,92.58 67.94,92.58 69.85,90.68 71.12,90.68 71.5,91.06 R42.1 72.14,91.57 75.56,95 75.56,104.65 | 75.56,104.65 79.88,104.65 LINEIN.SLEEVE 82.55,104.65 91.31,104.65 MICIN.SLEEVE 93.98,103 94.36,103 94.36,95.12 95.89,93.6 96.52,93.6 S0.1 | 75.56,104.65 71.12,104.65 LINEOUT.SLEEVE 68.45,104.65 59.69,104.65 HPHONE.SLEEVE 57.02,103 54.86,100.84 52.2,100.84 50.55,99.19 R39.1 49.78,99.19 47.24,99.19 47.24,104.39 J1.GND2 45.97,104.39 38.73,104.39 36.7,102.36 J1.6/VSS | J1.GND0 39.88,90.55 39.5,90.55 39.5,89.41 C11.2 38.61,89.41 38.1,89.92 30.1,89.92 28.19,88.01 U4.8 | J1.6/VSS 36.07,102.36 36.07,103.38 34.04,103.38 J1.GND1 | J1.6/VSS 36.7,100.97 35.31,99.57 28.57,99.57 28.19,99.95 U4.3 U4.38 | Q2.2 94.36,58.29 94.36,57.53 R51.2 93.85,57.02 93.73,56.9 v93.34,56.9 | v93.34,52.83 92.84,52.32 IC1.8 91.19,51.82 89.03,49.66 81.15,49.66 80.39,48.9 U2.6 78.99,48.9 77.85,50.04 76.07,50.04 75.31,50.8 U2.9 73.91,50.8 73.15,50.04 71.37,50.04 70.23,48.9 U2.14 68.83,48.9 68.07,49.66 63.37,49.66 62.61,48.9 U2.20 | v94.61,65.53 97.16,65.53 97.41,65.79 IC2.7 | C13.2 41.4,52.2 42.16,51.44 53.59,51.44 U2.25 | 92.84,76.33 92.84,80.52 94.36,80.52 94.74,80.14 R52.2 95.25,79.25 96.14,79.25 Q1.2 | 92.84,76.33 92.84,75.95 C3.2 | R41.1 R37.1 59.18,58.8 59.18,63.12 R38.1 59.44,63.88 65.66,70.1 69.47,70.1 73.66,74.3 73.66,75.69 | C1.2 66.04,81.53 67.44,81.53 U3.GND1 | 92.84,76.33 74.42,76.33 73.79,75.69 73.66,75.69 | Q6.2 12.06,22.99 12.06,23.5 R47.2 11.94,24 11.43,24.51 9.78,24.51 9.65,24.64 9.65,28.32 9.78,28.32 IC3.7 9.78,28.83 v9.14,28.83
  Bottom 0.305: R48.2 41.53,37.21 40.77,37.21 Q5.2 39.88,37.72 39.5,37.72 39.5,38.35 38.61,39.24 9.14,39.24 | 9.14,39.24 6.48,39.24 5.71,38.48 C4.2 | v9.14,31.37 9.14,39.24 | U5.24 40.51,61.47 40.13,61.85 28.19,61.85 U4.18 U4.23
  other vias: 78.11,61.59 13.97,93.98 20.32,93.34 40.01,85.72 61.59,104.78 73.03,104.78 84.45,104.78 93.98,99.06 84.45,91.44 84.45,83.82 79.38,83.82 76.2,80.64 80.01,79.38 87.63,72.39 86.36,64.77 87.63,59.69 87.63,54.61 83.19,54.61 69.22,54.61 67.94,60.33 71.12,69.22 71.12,76.83 59.05,73.03 53.34,70.48 60.33,67.94 64.77,69.22 64.14,77.47 60.96,76.83 50.8,74.3 39.37,64.77 34.92,62.23 16.51,64.77 13.97,74.93 15.24,69.22 1.91,100.33 5.71,49.53 1.27,39.37 7.62,2.54 91.44,2.54 109.22,2.54 207.65,2.54 213.36,7.62 211.46,35.56 214.63,41.27 213.36,50.16 213.36,100.33 207.65,104.78 163.19,105.41 103.5,105.41 53.98,61.59 38.73,57.15 33.66,52.07 26.04,52.07 22.23,52.07 26.04,45.09 44.45,43.81 48.9,41.27 49.53,30.48 41.91,27.94 96.52,29.21 113.03,46.35 118.75,46.35 123.83,46.99 137.16,41.27 156.84,45.09 169.54,45.72 181.61,45.09 194.31,46.35 198.75,45.09 55.88,88.27 214,75.56 29.84,96.52 49.53,96.52 146.69,29.84 137.79,33.66 137.79,27.94 144.78,25.4 136.53,21.59 128.91,20.95 137.16,16.51 110.49,44.45 101.6,46.99 100.33,57.78 99.06,60.96 104.78,27.94 107.95,25.4 104.14,25.4 107.95,13.97 48.9,17.14 96.52,33.02 128.91,30.48 157.48,33.02 151.13,28.57 159.38,25.4 156.84,22.23 156.84,19.05 156.84,16.51 170.81,13.34 135.89,13.97 156.84,11.43 156.84,8.89 156.84,5.71 170.81,33.02 164.47,33.66 178.44,33.66 185.42,33.02 191.13,27.94 191.77,24.77 191.77,22.23 191.13,16.51 191.77,13.34 198.75,8.89 198.75,5.71 205.74,13.97 208.28,38.73 207.65,56.52 208.28,67.94 207.65,75.56 208.28,90.81 156.84,57.15 156.84,53.34 156.84,50.8 156.84,60.33 156.84,68.58 156.84,72.39 156.84,74.93 156.84,80.01 156.84,83.19 136.53,79.38 136.53,74.93 119.38,74.93 119.38,77.47 114.94,83.82 114.94,80.01 114.3,53.34 163.83,22.23 205.74,38.1 209.87,39.05 197.49,38.73 194.31,34.29 200.66,31.11
  pour Top: 0,106.68 0,0 215.9,0 215.9,106.68 101.6,106.68 101.6,103.5 94.61,103.5 94.61,106.68
  pour Bottom: 0,106.68 0,0 215.9,0 215.9,106.68 101.6,106.68 101.6,103.5 94.61,103.5 94.61,106.68
K_INT  (via drill 0.25)
  Top 0.152: v48.01,24.38 29.08,43.31 29.08,48.01 27.94,49.15 27.94,56.52 U4.20
  Bottom 0.152: v48.01,24.38 112.27,24.38 112.52,24.64 124.84,24.64 125.09,24.38 126.11,24.38 126.49,24 213.49,24 213.49,31.5 212.22,32.77 206.5,32.77 U1.13
K_SCL  (via drill 0.25)
  Top 0.152: v162.18,31.62 149.99,19.43 149.99,16.51 144.65,11.18 42.93,11.18 42.93,22.86 28.7,37.08 28.7,47.88 25.02,51.56 25.02,81.28 25.65,81.92 U4.10
  Bottom 0.152: U4.10 R43.1 | v162.18,31.62 189.23,31.62 190.37,32.77 196.72,32.77 U1.28
K_SDA  (via drill 0.25)
  Top 0.152: U4.9 25.65,84.45 24.64,83.44 24.64,58.8 v24.51,58.67 24.64,58.55 24.64,50.55 v28.19,46.99 | v187.96,35.69 v191.39,32.26
  Bottom 0.152: v24.51,58.67 27.43,58.67 28.07,58.04 40.51,58.04 U5.17 | U4.9 R44.1 | v191.39,32.26 196.72,32.26 U1.27 | v187.96,35.69 170.94,35.69 170.43,36.2 168.02,36.2 167.89,36.07 148.21,36.07 147.45,36.83 122.3,36.83 119.51,39.62 93.98,39.62 91.44,42.16 90.42,42.16 85.6,46.99 v28.19,46.99
LATCH  (via drill 0.25)
  Top 0.152: v146.3,34.67 136.02,44.96 v136.02,47.62
  Bottom 0.152: v146.3,34.67 150.24,30.73 193.8,30.73 194.18,31.11 196.72,31.11 U1.26 | v136.02,47.62 135.25,48.39 99.31,48.39 IC1.12
LC1  (via drill 0.25)
  Top 0.152: v137.54,89.79 141.73,85.6 v141.73,43.81
  Bottom 0.152: v137.54,89.79 115.95,89.79 114.43,91.31 R24.1 | v141.73,43.81 141.35,43.43 IC4.4
LC2  (via drill 0.25)
  Top 0.152: v136.14,90.55 137.03,89.66 137.03,83.82 138.68,82.17 v138.68,45.47
  Bottom 0.152: v136.14,90.55 128.91,90.55 128.14,91.31 R25.1 | v138.68,45.47 139.45,44.7 IC4.5
LC3  (via drill 0.25)
  Top 0.152: v142.11,89.79 142.24,89.66 v142.24,46.86
  Bottom 0.152: v142.11,89.79 142.11,91.31 R26.1 | v142.24,46.86 141.35,45.97 IC4.6
LC4  (via drill 0.25)
  Top 0.152: v155.57,89.79 150.37,84.58 v150.37,46.86
  Bottom 0.152: v155.57,89.79 155.57,91.31 R27.1 | v150.37,46.86 148.21,44.7 147.57,44.7 IC4.10
LC5  (via drill 0.25)
  Top 0.152: v161.54,89.79 154.81,83.06 v154.81,47.88
  Bottom 0.152: v161.54,89.79 167.39,89.79 168.91,91.31 R28.1 | v154.81,47.88 150.37,43.43 147.57,43.43 IC4.11
LC6  (via drill 0.25)
  Top 0.152: v175.51,89.79 168.66,82.93 168.66,61.85 161.67,54.86 v161.67,42.42
  Bottom 0.152: v175.51,89.79 181.99,89.79 183.51,91.31 R29.1 | v161.67,42.42 161.42,42.16 147.57,42.16 IC4.12
LC7  (via drill 0.25)
  Top 0.152: v197.1,89.79 196.6,89.28 196.6,45.34 v193.55,42.29
  Bottom 0.152: v197.1,89.79 197.1,91.31 R30.1 | v193.55,42.29 192.91,41.66 148.34,41.66 147.57,40.89 IC4.13
LCCLK  (via drill 0.25)
  Top 0.152: v202.06,45.72 202.56,45.21 202.56,37.34 203.84,36.07 203.84,29.84 209.04,24.64 210.57,24.64 210.57,26.8 209.8,27.56 ISP.3
  Bottom 0.152: U1.17 204.6,28.57 208.91,28.57 ISP.3 | v202.06,45.72 199.39,48.39 148.72,48.39 147.57,47.24 IC4.8
LCDAT  (via drill 0.25)
  Top 0.152: ISP.1 209.3,26.42 208.53,27.18 208.53,28.7 v207.01,30.23 204.22,33.02 204.22,38.61 v203.2,39.62
  Bottom 0.152: IC4.1 140.46,39.62 140.46,40.39 IC4.2 141.35,40.89 143,42.55 161.04,42.55 161.42,42.93 199.9,42.93 v203.2,39.62 | v207.01,30.23 206.63,30.23 206.5,30.35 U1.16
LHP
  Bottom 0.152: HPHONE.TIP 59.05,93.6 R40.2 58.67,92.58 57.02,90.93 57.02,86.87 C24.-
LLIN
  Bottom 0.152: C16.1 81.92,93.6 LINEIN.TIP
LLOUT
  Bottom 0.152: R42.2 71.37,92.84 70.87,92.84 C27.2 70.48,93.6 LINEOUT.TIP
LM+  (via drill 0.25)
  Top 0.152: v70.36,72.64 v90.81,93.09
  Bottom 0.152: v70.36,72.64 60.58,72.64 54.36,66.42 C21.1 | v90.81,93.09 91.31,93.6 MICIN.TIP 93.34,93.6 R36.1
LM-
  Bottom 0.305: C20.1 R38.2
LRCLK  (via drill 0.25)
  Top 0.152: v205.1,49.28 207.01,47.37 207.01,36.32 211.07,32.26 211.07,29.72 211.84,28.96 ISP.4
  Bottom 0.152: U1.15 206.5,31.5 206.63,31.62 208.79,31.62 209.04,31.88 212.6,31.88 213.11,31.37 213.11,28.96 212.34,28.96 ISP.4 | v205.1,49.28 99.31,49.28 IC1.11
LRDAT  (via drill 0.25)
  Top 0.152: v201.68,32.38 201.55,32.51 v201.55,46.99
  Bottom 0.152: v201.68,32.38 205.36,32.38 U1.14 | v201.55,46.99 199.64,48.9 97.16,48.9 97.03,48.77 97.03,45.97 97.41,45.97 IC1.14
N$1
  Bottom 0.152: 108.08,81.79 108.71,82.42 S1.K | 108.08,81.79 104.9,78.61 98.81,78.61 Q1.3 | 122.05,81.79 122.68,82.42 S2.K | 122.05,81.79 108.08,81.79 | 136.02,81.79 136.65,82.42 S3.K | 136.02,81.79 122.05,81.79 | 149.99,81.79 150.62,82.42 S4.K | 149.99,81.79 136.02,81.79 | 163.96,81.79 164.59,82.42 S5.K | 163.96,81.79 149.99,81.79 | 177.93,81.79 178.56,82.42 S6.K | 177.93,81.79 163.96,81.79 | 191.9,81.79 192.53,82.42 S7.K | 177.93,81.79 191.9,81.79 | 191.9,81.79 205.87,81.79 206.5,82.42 S8.K
N$2  (via drill 0.25)
  Top 0.152: v99.82,71.37 101.47,73.03 v101.47,87.63
  Bottom 0.152: 116.08,89.28 103,89.28 102.74,89.03 D35.C 102.36,88.52 v101.47,87.63 | 116.08,89.28 116.33,89.03 D44.C | 130.05,89.28 130.3,89.03 D47.C | 130.05,89.28 116.08,89.28 | 144.02,89.28 144.27,89.03 D64.C | 144.02,89.28 130.05,89.28 | 157.99,89.28 158.24,89.03 D77.C | 157.99,89.28 144.02,89.28 | 171.96,89.28 172.21,89.03 D98.C | 171.96,89.28 157.99,89.28 | 185.93,89.28 186.18,89.03 D101.C | 171.96,89.28 185.93,89.28 | 185.93,89.28 199.9,89.28 200.15,89.03 D104.C | v99.82,71.37 99.31,71.37 IC2.3
N$3  (via drill 0.25)
  Top 0.152: v99.82,70.61 101.98,72.77 v101.98,79.12
  Bottom 0.152: v99.82,70.61 99.31,70.1 IC2.4 | v101.98,79.12 109.09,86.23 113.16,86.23 D36.C 113.54,86.23 113.79,85.98 125.22,85.98 125.48,86.23 127.13,86.23 D45.C 127.51,86.23 127.76,85.98 139.19,85.98 139.45,86.23 141.1,86.23 D48.C 141.48,86.23 141.73,85.98 153.16,85.98 153.42,86.23 155.07,86.23 D69.C 155.45,86.23 155.7,85.98 167.13,85.98 167.39,86.23 169.04,86.23 D78.C 169.42,86.23 169.67,85.98 181.1,85.98 181.36,86.23 183.01,86.23 D99.C 183.39,86.23 183.64,85.98 186.94,85.98 187.07,86.11 196.85,86.11 196.98,86.23 D102.C 197.36,86.23 198.63,84.96 204.34,84.96 D105.C
N$4  (via drill 0.25)
  Top 0.152: v103.38,67.44 106.05,70.1 v106.05,72.9
  Bottom 0.152: 120.14,74.04 107.19,74.04 106.93,73.79 D1.C 106.43,73.28 v106.05,72.9 | 120.14,74.04 120.4,73.79 D3.C | 134.11,74.04 134.37,73.79 D5.C | 134.11,74.04 120.14,74.04 | 148.08,74.04 148.34,73.79 D7.C | 148.08,74.04 134.11,74.04 | 162.05,74.04 162.31,73.79 D9.C | 162.05,74.04 148.08,74.04 | 176.02,74.04 176.28,73.79 D11.C | 176.02,74.04 162.05,74.04 | 189.99,74.04 190.25,73.79 D13.C | 189.99,74.04 176.02,74.04 | 189.99,74.04 203.96,74.04 204.22,73.79 D15.C | v103.38,67.44 99.31,67.44 IC2.6
N$5
  Bottom 0.152: D1.A 106.43,71.5 105.79,72.14 104.78,72.14 S1.NO
N$6
  Bottom 0.152: D2.A 109.47,73.28 110.11,72.64 111.12,72.64 S1.NC
N$7
  Bottom 0.152: 120.52,70.74 122.68,70.74 122.94,70.99 D4.C 123.44,70.99 132.33,70.99 132.59,70.74 136.65,70.74 136.91,70.99 D6.C 137.41,70.99 146.3,70.99 146.56,70.74 150.62,70.74 150.88,70.99 D8.C 151.38,70.99 160.27,70.99 160.53,70.74 164.59,70.74 164.85,70.99 D10.C 165.35,70.99 174.24,70.99 174.5,70.74 178.56,70.74 178.82,70.99 D12.C 179.32,70.99 188.21,70.99 188.47,70.74 192.53,70.74 192.79,70.99 D14.C 193.29,70.99 202.18,70.99 202.44,70.74 206.5,70.74 206.76,70.99 D16.C | 120.52,70.74 120.14,70.74 120.02,70.87 109.6,70.87 109.47,70.99 D2.C | 120.52,70.74 117.73,67.94 93.47,67.94 93.09,68.33 IC2.10
N$9
  Bottom 0.152: D3.A 120.4,71.5 119.76,72.14 118.75,72.14 S2.NO
N$10  (via drill 0.25)
  Top 0.152: v100.84,70.36 102.49,72.01 102.49,89.28 v107.19,93.98
  Bottom 0.152: D106.C 203.07,99.31 202.82,99.57 197.1,99.57 D103.C 196.6,99.82 183.13,99.82 D100.C 182.63,99.82 169.16,99.82 D97.C 168.66,99.82 155.19,99.82 D70.C 154.69,99.82 141.22,99.82 D63.C 140.72,99.82 127.25,99.82 D46.C 126.75,99.82 113.28,99.82 D43.C 112.78,99.57 v107.19,93.98 | v100.84,70.36 99.31,68.83 IC2.5
N$11
  Bottom 0.152: D4.A 123.44,73.28 124.08,72.64 125.09,72.64 S2.NC
N$12
  Bottom 0.152: D43.A 112.78,102.11 110.87,102.11 E1.SW1
N$13
  Bottom 0.152: D35.A 102.74,86.74 103.5,87.5 104.39,87.5 E1.A
N$14
  Bottom 0.152: Q2.3 95,61.09 92.2,61.09 91.95,61.34 91.95,62.74 108.08,62.74 108.71,63.37 S9.K 109.73,63.63 110.36,64.26 124.33,64.26 | 124.33,64.26 123.7,63.63 S10.K | 136.02,64.26 124.33,64.26 | 136.02,64.26 136.65,63.63 S11.K | 149.99,64.26 150.62,63.63 S12.K | 149.99,64.26 136.02,64.26 | 163.96,64.26 164.59,63.63 S13.K | 163.96,64.26 149.99,64.26 | 177.93,64.26 178.56,63.63 S14.K | 177.93,64.26 163.96,64.26 | 191.9,64.26 192.53,63.63 S15.K | 191.9,64.26 177.93,64.26 | 191.9,64.26 205.87,64.26 206.5,63.63 S16.K
N$15
  Bottom 0.152: D36.A 113.16,88.52 112.65,88.01 110.87,88.01 E1.B
N$16
  Bottom 0.152: D63.A 140.72,102.11 138.81,102.11 E3.SW1
N$17
  Bottom 0.152: D46.A 126.75,102.11 124.84,102.11 E2.SW1
N$18
  Bottom 0.152: D70.A 154.69,102.11 152.78,102.11 E4.SW1
N$19
  Bottom 0.152: D97.A 168.66,102.11 166.75,102.11 E5.SW1
N$20
  Bottom 0.152: D17.A 106.43,52.45 105.79,53.09 104.78,53.09 S9.NO
N$21
  Bottom 0.152: D100.A 182.63,102.11 180.72,102.11 E6.SW1
N$22
  Bottom 0.152: D103.A 196.6,102.11 194.69,102.11 E7.SW1
N$23
  Bottom 0.152: D18.A 109.47,54.23 110.11,53.59 111.12,53.59 S9.NC
N$24
  Bottom 0.152: D106.A 205.87,99.31 208.15,101.6 E8.SW1
N$25
  Bottom 0.152: D44.A 116.71,86.74 117.47,87.5 118.36,87.5 E2.A
N$26
  Bottom 0.152: Q7.3 105.54,92.46 106.05,92.46 R15.2
N$27
  Bottom 0.152: D45.A 127.13,88.52 126.62,88.01 124.84,88.01 E2.B
N$28
  Bottom 0.152: D47.A 130.68,86.74 131.44,87.5 132.33,87.5 E3.A
N$29  (via drill 0.25)
  Top 0.152: v95.63,68.83 101.85,62.61 v101.85,55.88
  Bottom 0.152: 120.14,54.99 107.19,54.99 106.93,54.74 D17.C 106.43,54.74 103,54.74 v101.85,55.88 | 120.14,54.99 120.4,54.74 D19.C | 134.11,54.99 134.37,54.74 D21.C | 134.11,54.99 120.14,54.99 | 148.08,54.99 148.34,54.74 D23.C | 148.08,54.99 134.11,54.99 | 162.05,54.99 162.31,54.74 D25.C | 162.05,54.99 148.08,54.99 | 176.02,54.99 176.28,54.74 D27.C | 176.02,54.99 162.05,54.99 | 189.99,54.99 190.25,54.74 D29.C | 189.99,54.99 176.02,54.99 | 189.99,54.99 203.96,54.99 204.22,54.74 D31.C | v95.63,68.83 93.85,68.83 93.09,69.6 IC2.11
N$30
  Bottom 0.152: D5.A 134.37,71.5 133.73,72.14 132.72,72.14 S3.NO
N$31
  Bottom 0.152: D6.A 137.41,73.28 138.05,72.64 139.06,72.64 S3.NC
N$32
  Bottom 0.152: D7.A 148.34,71.5 147.7,72.14 146.69,72.14 S4.NO
N$33
  Bottom 0.152: D8.A 151.38,73.28 152.02,72.64 153.03,72.64 S4.NC
N$34
  Bottom 0.152: D9.A 162.31,71.5 161.67,72.14 160.66,72.14 S5.NO
N$35
  Bottom 0.152: D10.A 165.35,73.28 165.99,72.64 167,72.64 S5.NC
N$36
  Bottom 0.152: D11.A 176.28,71.5 175.64,72.14 174.62,72.14 S6.NO
N$37
  Bottom 0.152: D12.A 179.32,73.28 179.96,72.64 180.97,72.64 S6.NC
N$38
  Bottom 0.152: D13.A 190.25,71.5 189.61,72.14 188.59,72.14 S7.NO
N$39
  Bottom 0.152: D14.A 193.29,73.28 193.93,72.64 194.94,72.64 S7.NC
N$40
  Bottom 0.152: D15.A 204.22,71.5 203.58,72.14 202.56,72.14 S8.NO
N$41
  Bottom 0.152: D16.A 207.26,73.28 207.9,72.64 208.91,72.64 S8.NC
N$42  (via drill 0.25)
  Top 0.152: v95.63,69.85 102.36,63.12 v102.36,54.61
  Bottom 0.152: D32.C 206.76,51.94 206.5,51.69 202.44,51.69 202.18,51.94 193.29,51.94 D30.C 192.79,51.94 192.53,51.69 188.47,51.69 188.21,51.94 179.32,51.94 D28.C 178.82,51.94 178.56,51.69 174.5,51.69 174.24,51.94 165.35,51.94 D26.C 164.85,51.94 164.59,51.69 160.53,51.69 160.27,51.94 151.38,51.94 D24.C 150.88,51.94 150.62,51.69 146.56,51.69 146.3,51.94 137.41,51.94 D22.C 136.91,51.94 136.65,51.69 132.59,51.69 132.33,51.94 123.44,51.94 D20.C 122.94,51.94 122.68,51.69 120.14,51.69 120.02,51.82 109.6,51.82 109.47,51.94 D18.C 108.97,52.45 107.57,52.45 105.66,54.36 102.62,54.36 v102.36,54.61 | v95.63,69.85 94.11,69.85 93.09,70.87 IC2.12
N$43
  Bottom 0.152: Q1.1 96.14,77.98 95.25,77.98 R1.2
N$44
  Bottom 0.152: D48.A 141.1,88.52 140.59,88.01 138.81,88.01 E3.B
N$45
  Bottom 0.152: D19.A 120.4,52.45 119.76,53.09 118.75,53.09 S10.NO
N$46
  Bottom 0.152: D20.A 123.44,54.23 124.08,53.59 125.09,53.59 S10.NC
N$47
  Bottom 0.152: D64.A 144.65,86.74 145.41,87.5 146.3,87.5 E4.A
N$48
  Bottom 0.152: Q3.1 129.92,42.67 129.92,43.43 R3.2
N$49
  Bottom 0.152: D69.A 155.07,88.52 154.56,88.01 152.78,88.01 E4.B
N$50
  Bottom 0.152: D77.A 158.62,86.74 159.38,87.5 160.27,87.5 E5.A
N$51
  Bottom 0.152: Q4.1 122.56,23.24 122.56,23.75 R4.2
N$52
  Bottom 0.152: D78.A 169.04,88.52 168.53,88.01 166.75,88.01 E5.B
N$53
  Bottom 0.152: D98.A 172.59,86.74 173.35,87.5 174.24,87.5 E6.A
N$54
  Bottom 0.152: Q5.1 40.77,38.86 41.53,38.86 R5.2
N$55
  Bottom 0.152: D99.A 183.01,88.52 182.5,88.01 180.72,88.01 E6.B
N$56
  Bottom 0.152: D101.A 186.56,86.74 187.32,87.5 188.21,87.5 E7.A
N$57
  Bottom 0.152: Q6.1 10.79,22.99 10.79,23.5 R6.2
N$58
  Bottom 0.152: D102.A 196.98,88.52 196.47,88.01 194.69,88.01 E7.B
N$59
  Bottom 0.152: D21.A 134.37,52.45 133.73,53.09 132.72,53.09 S11.NO
N$60
  Bottom 0.152: D22.A 137.41,54.23 138.05,53.59 139.06,53.59 S11.NC
N$61
  Bottom 0.152: D23.A 148.34,52.45 147.7,53.09 146.69,53.09 S12.NO
N$62
  Bottom 0.152: D24.A 151.38,54.23 152.02,53.59 153.03,53.59 S12.NC
N$63
  Bottom 0.152: D25.A 162.31,52.45 161.67,53.09 160.66,53.09 S13.NO
N$64
  Bottom 0.152: D26.A 165.35,54.23 165.99,53.59 167,53.59 S13.NC
N$65
  Bottom 0.152: D27.A 176.28,52.45 175.64,53.09 174.62,53.09 S14.NO
N$66
  Bottom 0.152: D28.A 179.32,54.23 179.96,53.59 180.97,53.59 S14.NC
N$67
  Bottom 0.152: D29.A 190.25,52.45 189.61,53.09 188.59,53.09 S15.NO
N$68
  Bottom 0.152: D30.A 193.29,54.23 193.93,53.59 194.94,53.59 S15.NC
N$69
  Bottom 0.152: D31.A 204.22,52.45 203.58,53.09 202.56,53.09 S16.NO
N$70
  Bottom 0.152: D32.A 207.26,54.23 207.9,53.59 208.91,53.59 S16.NC
N$71
  Bottom 0.152: Q3.3 130.68,39.88 130.68,38.61 S17.K 131.32,38.23 131.95,38.86 139.19,38.86 139.32,38.73 153.16,38.73 153.29,38.86 159.89,38.86 | 159.89,38.86 159.26,38.23 S19.K | 159.89,38.86 171.58,38.86 | 171.58,38.86 172.21,38.23 S20.K | 171.58,38.86 185.55,38.86 186.18,38.23 S21.K
N$72
  Bottom 0.152: D104.A 200.53,86.74 201.29,87.5 202.18,87.5 E8.A
N$73
  Bottom 0.152: D33.A 128.02,27.05 127.38,27.69 126.36,27.69 S17.NO
N$74
  Bottom 0.152: D34.A 131.06,28.83 131.7,28.19 132.72,28.19 S17.NC
N$75
  Bottom 0.152: R2.2 96.14,57.53 96.14,58.29 Q2.1
N$77  (via drill 0.25)
  Top 0.152: v115.7,34.29 v121.03,28.96
  Bottom 0.152: D42.C 186.44,26.54 186.31,26.42 184.78,26.42 184.66,26.29 182.12,26.29 181.86,26.54 172.97,26.54 D40.C 172.47,26.54 172.21,26.29 168.15,26.29 167.89,26.54 159,26.54 D38.C 158.5,26.54 158.24,26.29 155.7,26.29 155.57,26.42 131.19,26.42 131.06,26.54 D34.C 130.56,27.05 129.16,27.05 127.25,28.96 v121.03,28.96 | v115.7,34.29 12.06,34.29 11.68,33.91 IC3.3
N$78
  Bottom 0.152: D105.A 207.14,84.96 207.14,87.38 207.26,87.38 E8.B
N$80  (via drill 0.25)
  Top 0.152: v201.68,26.42 201.8,26.54 v201.8,27.94
  Bottom 0.152: v201.68,26.42 201.68,25.78 C8.1 | v201.8,27.94 201.8,28.45 U1.20
N$81
  Bottom 0.152: C10.2 208.28,43.43 X1.2 208.03,42.29 208.03,41.66 204.6,38.23 U1.8
N$82
  Bottom 0.152: C9.2 203.58,46.61 203.58,43.43 X1.1 203.71,42.29 203.71,38.23 U1.7
N$83
  Top 0.152: U3.EN 67.69,74.17 67.06,74.8 67.06,81.66 80.14,94.74 100.08,94.74 100.08,92.58 99.31,91.82 S0.2
N$84
  Bottom 0.305: C15.1 41.27,68.58 42.43,67.42 U5.27
N$85  (via drill 0.25)
  Top 0.152: v93.85,74.17 95.12,72.9 v95.12,46.99
  Bottom 0.152: R52.1 93.6,79.25 93.6,78.36 R1.1 93.85,77.6 v93.85,74.17 | v95.12,46.99 97.41,44.7 IC1.15
N$86  (via drill 0.25)
  Top 0.152: v93.98,43.31 v93.98,49.53
  Bottom 0.152: R2.1 95.76,55.88 94.74,55.88 R51.1 93.98,55.5 v93.98,49.53 | v93.98,43.31 93.09,43.31 IC1.1
N$87
  Bottom 0.152: R50.1 131.06,45.21 129.92,45.21 R3.1 129.16,44.96 127.25,43.05 100.2,43.05 99.44,43.81 93.47,43.81 93.09,44.2 IC1.2
N$88  (via drill 0.25)
  Top 0.152: v104.9,30.99 93.47,42.42 v93.47,45.09
  Bottom 0.152: R49.1 123.7,25.53 122.68,25.53 R4.1 121.79,25.78 120.65,26.92 117.86,26.92 113.79,30.99 v104.9,30.99 | v93.47,45.09 93.09,45.47 IC1.3
N$89  (via drill 0.25)
  Top 0.152: v87.76,43.94 v90.17,46.35
  Bottom 0.152: R48.1 43.31,37.59 43.31,38.61 R5.1 43.56,39.5 48.01,43.94 v87.76,43.94 | v90.17,46.35 90.55,46.74 91.19,46.74 IC1.4
N$90  (via drill 0.25)
  Top 0.152: v56.77,23.88 v80.39,47.5
  Bottom 0.152: R6.1 10.92,25.15 11.94,25.15 R47.1 12.83,24.89 13.84,23.88 v56.77,23.88 | v80.39,47.5 90.68,47.5 91.19,48.01 IC1.5
N$91
  Bottom 0.152: Q8.3 119.51,92.46 120.02,92.46 R16.2
N$92
  Bottom 0.152: Q9.3 133.1,92.46 133.6,92.46 R17.2
N$93
  Bottom 0.152: Q10.3 147.07,92.46 147.57,92.46 R18.2
N$94
  Bottom 0.152: D37.A 155.96,27.05 155.32,27.69 154.31,27.69 S19.NO
N$95
  Bottom 0.152: D38.A 159,28.83 159.64,28.19 160.66,28.19 S19.NC
N$96
  Bottom 0.152: D39.A 169.93,27.05 169.29,27.69 168.28,27.69 S20.NO
N$97
  Bottom 0.152: D40.A 172.97,28.83 173.61,28.19 174.62,28.19 S20.NC
N$98
  Bottom 0.152: D41.A 183.9,27.05 183.26,27.69 182.25,27.69 S21.NO
N$99
  Bottom 0.152: D42.A 186.94,28.83 187.58,28.19 188.59,28.19 S21.NC
N$100
  Bottom 0.152: Q11.3 161.04,92.46 161.54,92.46 R19.2
N$101
  Bottom 0.152: Q12.3 174.37,92.46 174.88,92.46 R20.2
N$102
  Bottom 0.152: Q13.3 188.98,92.46 189.48,92.46 R21.2
N$103
  Bottom 0.152: Q14.3 202.95,92.46 203.45,92.46 R22.2
N$104
  Bottom 0.152: R23.2 103.5,90.81 103.5,91.44 Q7.1
N$105
  Bottom 0.152: R24.2 115.95,91.82 116.71,91.82 Q8.1
N$106
  Bottom 0.152: 123.19,19.81 Q4.3 | S25.K 123.19,19.81 | 123.19,19.81 136.02,19.81 136.65,19.18 S26.K 137.67,19.18 138.3,19.81 152.27,19.81 | 152.27,19.81 151.64,19.18 S27.K | 152.27,19.81 163.96,19.81 | 163.96,19.81 164.59,19.18 S28.K | 177.93,19.81 178.56,19.18 S29.K | 163.96,19.81 177.93,19.81 | 191.9,19.81 192.53,19.18 S30.K | 177.93,19.81 191.9,19.81 | 191.9,19.81 205.87,19.81 206.5,19.18 S31.K
N$107
  Bottom 0.152: D49.A 120.4,8 119.76,8.64 118.75,8.64 S25.NO
N$108
  Bottom 0.152: D50.A 123.44,9.78 124.08,9.14 125.09,9.14 S25.NC
N$109
  Bottom 0.152: R25.2 129.54,91.82 130.43,91.82 Q9.1
N$110  (via drill 0.25)
  Top 0.152: v26.67,30.61 26.67,25.15 v40.77,11.05
  Bottom 0.152: 134.11,10.54 121.16,10.54 120.9,10.29 D49.C 120.4,10.29 119.76,10.92 40.89,10.92 v40.77,11.05 | 134.11,10.54 134.37,10.29 D51.C | 148.08,10.54 148.34,10.29 D53.C | 134.11,10.54 148.08,10.54 | 162.05,10.54 162.31,10.29 D55.C | 148.08,10.54 162.05,10.54 | 176.02,10.54 176.28,10.29 D57.C | 162.05,10.54 176.02,10.54 | 189.99,10.54 190.25,10.29 D59.C | 176.02,10.54 189.99,10.54 | 189.99,10.54 203.96,10.54 204.22,10.29 D61.C | v26.67,30.61 13.21,30.61 11.68,32.13 IC3.4
N$111  (via drill 0.25)
  Top 0.152: v27.18,30.1 40.89,16.38 40.89,12.7 43.69,9.91 v119.63,9.91
  Bottom 0.152: D62.C 206.76,7.49 206.5,7.24 202.44,7.24 202.18,7.49 193.29,7.49 D60.C 192.79,7.49 192.53,7.24 188.47,7.24 188.21,7.49 179.32,7.49 D58.C 178.82,7.49 178.56,7.24 174.5,7.24 174.24,7.49 165.35,7.49 D56.C 164.85,7.49 164.59,7.24 160.53,7.24 160.27,7.49 151.38,7.49 D54.C 150.88,7.49 150.62,7.24 146.56,7.24 146.3,7.49 137.41,7.49 D52.C 136.91,7.49 136.65,7.24 134.11,7.24 133.99,7.37 123.57,7.37 123.44,7.49 D50.C 122.94,8 121.54,8 v119.63,9.91 | v27.18,30.1 12.45,30.1 11.68,30.86 IC3.5
N$112  (via drill 0.25)
  Top 0.152: v58.29,60.45 66.17,68.33 v66.17,84.58
  Bottom 0.152: v58.29,60.45 45.85,60.45 U5.3 | v66.17,84.58 70.87,89.28 79.76,89.28 81.53,91.06 C16.2
N$113
  Bottom 0.152: D51.A 134.37,8 133.73,8.64 132.72,8.64 S26.NO
N$114
  Bottom 0.152: D52.A 137.41,9.78 138.05,9.14 139.06,9.14 S26.NC
N$115  (via drill 0.25)
  Top 0.152: v58.29,57.66 66.67,66.04 66.67,92.71 v72.26,98.3
  Bottom 0.152: v58.29,57.66 52.2,57.66 50.93,58.93 45.85,58.93 U5.6 | v72.26,98.3 72.64,98.68 C17.2
N$121
  Bottom 0.152: D53.A 148.34,8 147.7,8.64 146.69,8.64 S27.NO
N$122
  Bottom 0.152: D54.A 151.38,9.78 152.02,9.14 153.03,9.14 S27.NC
N$123
  Bottom 0.152: D55.A 162.31,8 161.67,8.64 160.66,8.64 S28.NO
N$124
  Bottom 0.152: D56.A 165.35,9.78 165.99,9.14 167,9.14 S28.NC
N$125
  Bottom 0.152: D57.A 176.28,8 175.64,8.64 174.62,8.64 S29.NO
N$126
  Bottom 0.152: D58.A 179.32,9.78 179.96,9.14 180.97,9.14 S29.NC
N$127
  Bottom 0.152: D59.A 190.25,8 189.61,8.64 188.59,8.64 S30.NO
N$128
  Bottom 0.152: D60.A 193.29,9.78 193.93,9.14 194.94,9.14 S30.NC
N$129
  Bottom 0.152: D61.A 204.22,8 203.58,8.64 202.56,8.64 S31.NO
N$130
  Bottom 0.152: D62.A 207.26,9.78 207.9,9.14 208.91,9.14 S31.NC
N$131
  Bottom 0.152: R26.2 143.51,91.82 144.4,91.82 Q10.1
N$132
  Bottom 0.152: R27.2 157.48,91.82 158.37,91.82 Q11.1
N$133